# Altium schematic sheet Receiver.SchDoc
size A4
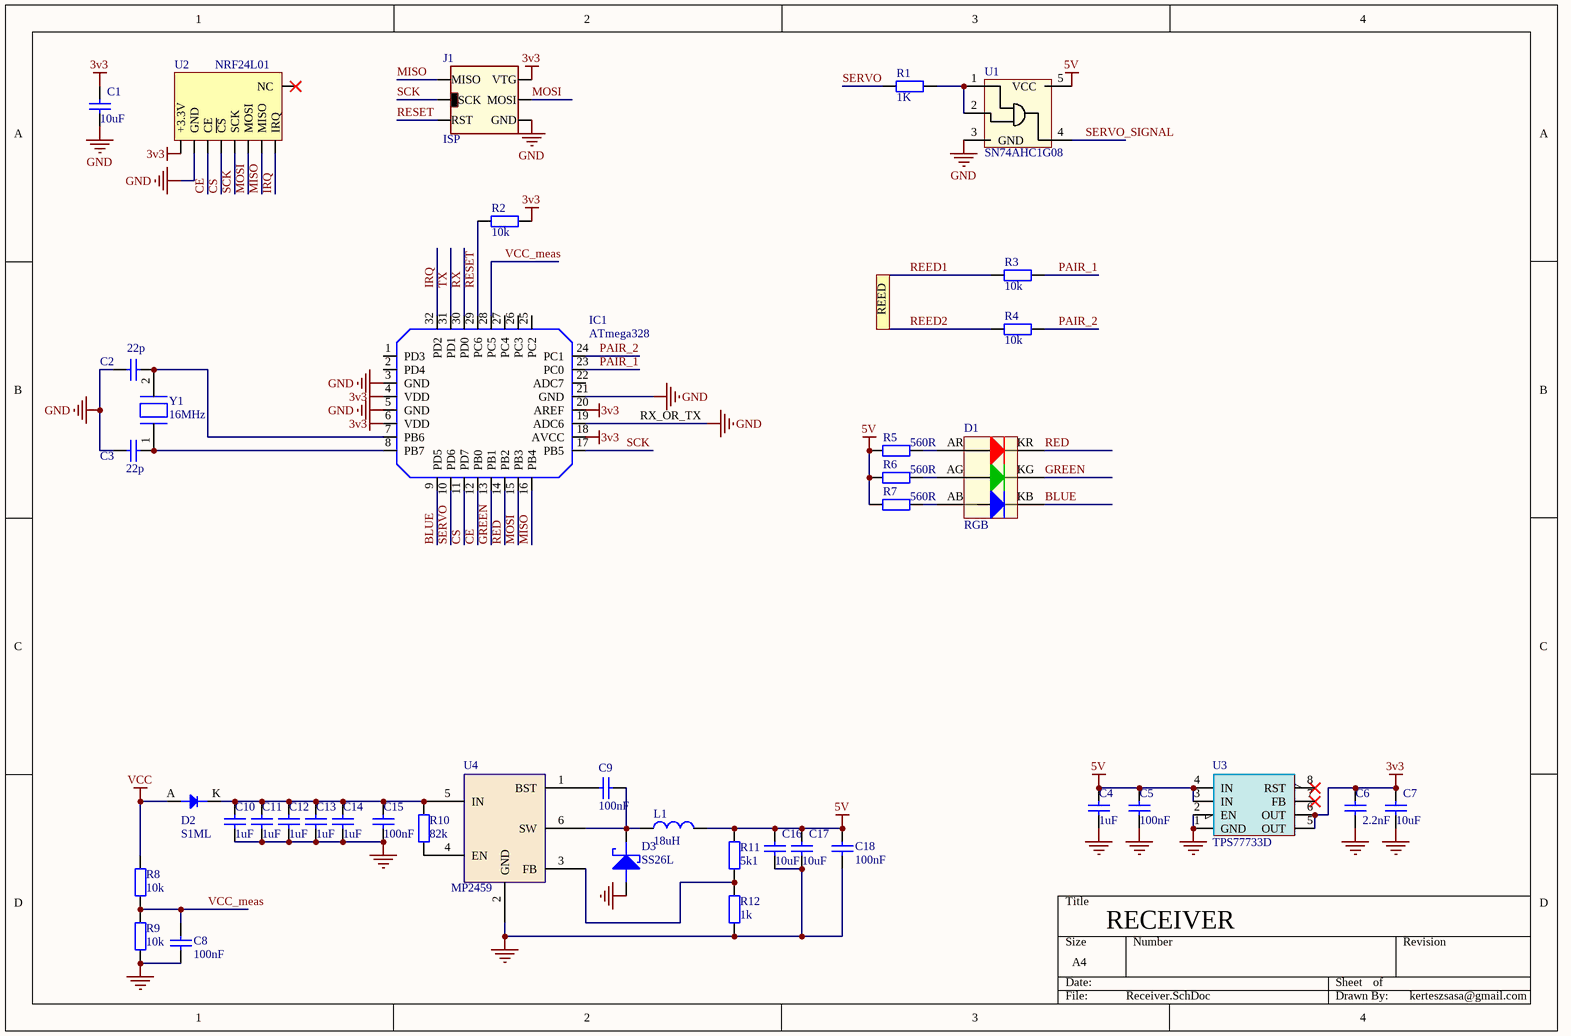
[diagram p0: Receiver.SchDoc]

## Parts
C1  10uF  [FP_0603_CAP_080]
C2  22p  [FP_0603_CAP_080]
C3  22p  [FP_0603_CAP_080]
C4  1uF  [FP_0603_CAP_080]
C5  100nF  [FP_0603_CAP_080]
C6  2.2nF  [FP_0603_CAP_080]
C7  10uF  [FP_0603_CAP_080]
C8  100nF  [FP_0603_CAP_080]
C9  100nF  [FP_0603_CAP_080]
C10  1uF  [FP_0805_CAP_145]
C11  1uF  [FP_0805_CAP_145]
C12  1uF  [FP_0805_CAP_145]
C13  1uF  [FP_0805_CAP_145]
C14  1uF  [FP_0805_CAP_145]
C15  100nF  [FP_0603_CAP_080]
C16  10uF  [FP_0603_CAP_080]
C17  10uF  [FP_0603_CAP_080]
C18  100nF  [FP_0603_CAP_080]
D1  RGB  [RGB_LED_5.0x5.0mm]
D2  S1ML  [subsma]
D3  SS26L  [subsma]
IC1  ATmega328  [TQFP32_N]
J1  ISP  [AVR_ISP]  (no BOM)
L1  18uH  [SDR0403_IND_4.5x5mm]
R1  1K  [FP_0603_RES]
R2  10k  [FP_0603_RES]
R3  10k  [FP_0603_RES]
R4  10k  [FP_0603_RES]
R5  560R  [FP_0603_RES]
R6  560R  [FP_0603_RES]
R7  560R  [FP_0603_RES]
R8  10k  [FP_0603_RES]
R9  10k  [FP_0603_RES]
R10  82k  [FP_0603_RES]
R11  5k1  [FP_0603_RES]
R12  1k  [FP_0603_RES]
U1  SN74AHC1G08  [GATE_SOT23-5]
U2  NRF24L01  [NRF24L01_SMD]
U3  TPS77733D  [DIGITAL_SOIC8]
U4  MP2459  [Supply_SOT23-6]
Y1  16MHz  [FP_CRYSTAL_HC49_SMD]

## Nets
3v3: C1.2 C6.2 C7.2 IC1.4(VDD) IC1.6(VDD) IC1.18(AVCC) IC1.20(AREF) J1.2(VTG) R2.2 U2.1(+3.3V) U3.5(OUT) U3.6(OUT)
5V: C4.2 C5.2 C16.2 C17.2 C18.1 L1.2 R5.2 R6.2 R7.2 R11.1 U1.5(VCC) U3.3(IN) U3.4(IN)
GND: C1.1 C2.1 C3.1 C4.1 C5.1 C6.1 C7.1 C8.2 C10.1 C11.1 C12.1 C13.1 C14.1 C15.2 C16.1 C17.1 C18.2 D3.A IC1.3(GND) IC1.5(GND) IC1.19(ADC6) IC1.21(GND) J1.6(GND) R9.1 R12.2 U1.3(GND) U2.2(GND) U3.1(GND) U3.2(EN) U4.2(GND)
VCC: D2.A R8.2
BLUE: D1.KB(R) IC1.9(PD5)
CE: IC1.12(PB0) U2.3(CE)
CS: IC1.11(PD7) U2.4(~{CS})
GREEN: D1.KG(G) IC1.13(PB1)
IRQ: IC1.32(PD2) U2.8(IRQ)
MISO: IC1.16(PB4) J1.1(MISO) U2.7(MISO)
MOSI: IC1.15(PB3) J1.4(MOSI) U2.6(MOSI)
PAIR_1: IC1.23(PC0) R3.2
PAIR_2: IC1.24(PC1) R4.2
RED: D1.KR(B) IC1.14(PB2)
REED1: R3.1
REED2: R4.1
RESET: IC1.29(PC6) J1.5(RST) R2.1
RX: IC1.30(PD0)
SCK: IC1.17(PB5) J1.3(SCK) U2.5(SCK)
SERVO: IC1.10(PD6) R1.1
SERVO_SIGNAL: U1.4(Y)
TX: IC1.31(PD1)
VCC_meas: C8.1 IC1.28(PC5) R8.1 R9.2
NetC2_2: C2.2 IC1.7(PB6) Y1.2
NetC3_2: C3.2 IC1.8(PB7) Y1.1
NetC9_1: C9.1 D3.K L1.1 U4.6(SW)
NetC9_2: C9.2 U4.1(BST)
NetC10_2: C10.2 C11.2 C12.2 C13.2 C14.2 C15.1 D2.K R10.1 U4.5(IN)
NetD1_AB: D1.AB(A) R7.1
NetD1_AG: D1.AG(A) R6.1
NetD1_AR: D1.AR(A) R5.1
NetR1_2: R1.2 U1.1(A) U1.2(B)
NetR10_2: R10.2 U4.4(EN)
NetR11_2: R11.2 R12.1 U4.3(FB)

Not connected (* = marked no-connect by the designer): IC1 1(PD3) 2(PD4) 22(ADC7) 25(PC2) 26(PC3) 27(PC4); U2 9(NC)*; U3 7(FB)* 8(RST)*

## Notes on the sheet
- REED
- RX_OR_TX
- RECEIVER
- kerteszsasa@gmail.com

## Library data of the parts
C1-C9 C15-C18 = Cap: Capacitor; Leírás: Capacitor ceramic X7R
  C1 C7 C16 C17: Value: 10uF; Order info: 82-07-81
  C2 C3: Value: 22p; Order info: 82-02-18
  C4: Order info: 82-08-08; Value: 1uF
  C5: Value: 100nF; Order info: 82-04-85
  C6: Value: 2.2nF; Order info: 82-02-41
  C8 C9 C15 C18: Value: 100nF; Order info: 82-06-23
C10-C14 = CAP: Capacitor; Leírás: Capacitor ceramic X7R; Value: 1uF; Order info: 82-07-84
D1 = LED_RGB_6_PIN: Leírás: RGB led; Order info: 95-02-90
D2 = DIODE: Order info: 83-00-35; Leírás: Diode
D3 = SCHOTTKY: NXP - PMEG3020EJ,115 - SCHOTTKY RECT 30V 2A SOD323F; Leírás: Diode; Order info: 83-02-21
J1 = ISP: Programozó csatlakozó; Order info: nem kell; Leírás: Programozó csatlakozó
L1 = L: Inductor; Order info: http://hu.mouser.com/ProductDetail/Bourns/SDR0403-180ML/?qs=%2fha2pyFadugaUgAfXzcwcLna1ckgYO6S0a7jYHnPAq4GNedMqyioAg%3d%3d; Leírás: Inductor
R1 R10 = RES: Resistor; Leírás: Resistor
  R1: Value: 1K; Order info: 80-11-59
  R10: Value: 82k; Order info: 81-10-49
R2-R9 R11 R12 = Res3: Resistor; Leírás: Resistor
  R2-R4 R8 R9: Value: 10k; Order info: 80-11-68
  R5-R7: Value: 560R; Order info: 81-04-19
  R11: Value: 5k1; Order info: 80-11-67
  R12: Value: 1k; Order info: 80-11-59
U1 = SN74AHC1G08: 1x2-INPUT AND-GATE; Leírás: AND-GATE 1x2-INPUT; Order info: 87-02-78
U2 = NRF24L01: 2.4Ghz RF module; Leírás: 2.4GHz RF module; Order info: http://www.ebay.com/itm/Mini-NRF24L01-SMD-1-27MM-wireless-transceiver-module-Small-Size/321938267213?_trksid=p2047675.c100005.m1851&_trkparms=aid%3D222007%26algo%3DSIC.MBE%26ao%3D1%26asc%3D20131003132420%26meid%3D79cec08809324ce588edcca11bd960b9%26pid%3D100005%26rk%3D2%26rkt%3D6%26sd%3D131725655413
U3 = TPS77733D: LDO Voltage Regulators Fast-Tran-Res 750-mA; Order info: http://hu.mouser.com/ProductDetail/Texas-Instruments/TPS77733D/?qs=sGAEpiMZZMsGz1a6aV8DcPXeWoVS0FnzzBFSSaOk9hM%3d; Leírás: LDO Voltage Regulators Fast-Tran-Res 750-mA
U4 = MP2459: 0.5A, 55V, 480kHz  Step-Down Converter in a TSOT23-6; Leírás: DC-DC converter; Order info: http://hu.mouser.com/ProductDetail/Monolithic-Power-Systems-MPS/MP2459GJ-Z/?qs=sGAEpiMZZMtitjHzVIkrqWVTGjLJY%2f0AdgGEc3azCiA%3d
Y1 = XTAL HC49: Standard HC49 quartz; Leírás: 16MHz Quartz HC49; Value: 16MHz; Order info: 40-01-26
IC1 = ATmega328: Order info: http://hu.mouser.com/Semiconductors/Embedded-Processors-Controllers/Microcontrollers-MCU/8-bit-Microcontrollers-MCU/_/N-a85ik?P=1z0y146&Keyword=atmega328&FS=True&Ns=Pricing|0; Leírás: ATmega328